# Altium schematic sheet POWER.SchDoc
size A4
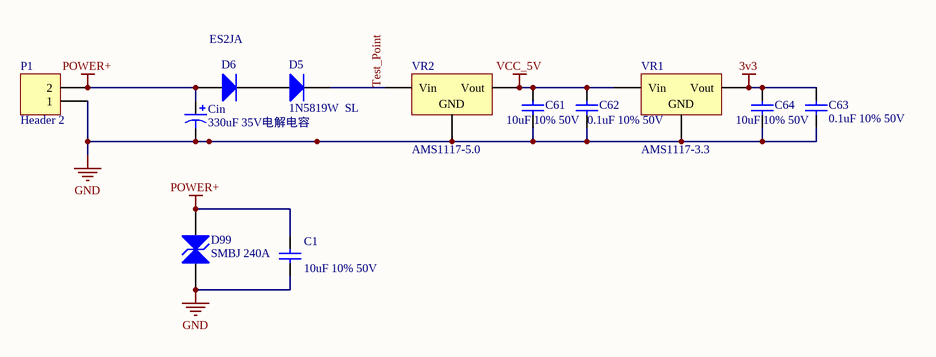
[diagram p0: POWER.SchDoc]

## Parts
C1  10uF 10% 50V  [0805_C]
C61  10uF 10% 50V  [0805_C]
C62  0.1uF 10% 50V  [0603_C]
C63  0.1uF 10% 50V  [0603_C]
C64  10uF 10% 50V  [0805_C]
Cin  330uF 35V电解电容  [330uf/35V]
D5  1N5819W  SL  [SOD-123]
D6  ES2JA  [SMA(DO-214AC)_S1]
D99  SMBJ 240A  [SMB(DO-214AA)_S1]
P1  Header 2  [2星座子]
VR1  AMS1117-3.3  [SOT-223]
VR2  AMS1117-5.0  [SOT-223]

## Nets
3v3: C63.2 C64.1 VR1.2(Vout)
GND: C1.2 C61.2 C62.1 C63.1 C64.2 Cin.2 D99.1(A) P1.1 VR1.1(GND) VR2.1(GND)
POWER+: C1.1 Cin.1 D6.1(A) D99.2(K) P1.2
VCC_5V: C61.1 C62.2 VR1.3(Vin) VR2.2(Vout)
Test_Point: D5.2(K) VR2.3(Vin)
NetD5_1: D5.1(A) D6.2(K)

## Library data of the parts
C1 C61-C64 = Cap Semi: Capacitor (Semiconductor SIM Model); Published: 8-Jun-2000; PackageReference: C1206; Publisher: Altium Limited
  C1 C61 C64: LatestRevisionDate: 29-May-2009; LatestRevisionNote: IPC-7351 Footprint Added.; Value: 10uF 10% 50V; PackageDescription: Chip Capacitor
  C62 C63: LatestRevisionDate: 17-Jul-2002; LatestRevisionNote: Re-released for DXP Platform.; Value: 0.1uF 10% 50V
Cin = Cap Pol1: Polarized Capacitor (Radial); Published: 8-Jun-2000; LatestRevisionDate: 17-Jul-2002; LatestRevisionNote: Re-released for DXP Platform.; PackageReference: RB7.6-15; Publisher: Altium Limited; PackageDescription: Polarized Capacitor (Radial); 2 Leads; Value: 330uF 35V
D5 = SOD-123 B5819W  SL: 肖特基二极管; ComponentLink1Description: 供应商链接; ComponentLink1URL: http://www.szlcsc.com/product/details_9093.html; Package: SOD-123; Supplier: LC; SuppliersPartNumber: C8598
D6 = SMA(DO-214AC) M7: 二极管; 备注: 1N4007 4007 编号C2464 已经停售, 使用新物料编号C95872; ComponentLink1Description: 供应商链接; ComponentLink1URL: http://www.szlcsc.com/product/details_2841.html; Package: SMA(DO-214AC); Supplier: LC; SuppliersPartNumber: C95872
D99 = SMB/DO-214AA P6SMB6.8CA: TVS; ComponentLink1Description: 供应商链接; ComponentLink1URL: http://www.szlcsc.com/product/details_79530.html; Package: SMB/DO-214AA; Supplier: LC; SuppliersPartNumber: C78395
P1 = Header 2: Header, 2-Pin; LatestRevisionDate: 17-Jul-2002; LatestRevisionNote: Re-released for DXP Platform.; Publisher: Altium Limited
VR1 VR2 = SOT-223 AMS1117-5.0: 低压差线性稳压(LDO); ComponentLink1Description: 供应商链接; ComponentLink1URL: http://www.szlcsc.com/product/details_6653.html; Package: SOT-223; Supplier: LC; SuppliersPartNumber: C6187